# EAGLE design RELE_TTL (EAGLE 7.2.0)
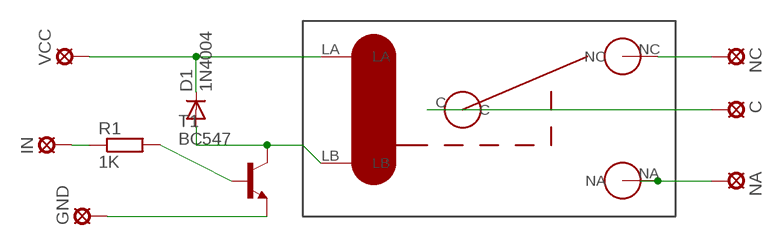
[diagram p0: schematic, sheet 1]

## Parts
C  LSP10  [LSP10]
D1  1N4004  [DO41-10]
GND  LSP10  [LSP10]
IN  LSP10  [LSP10]
NA  LSP10  [LSP10]
NC  LSP10  [LSP10]
R1  1K  R-EU_0207/2V  [0207/2V]
RL1  RELE  [RELE_1]
T1  BC547  [TO92]
VCC  LSP10  [LSP10]

## Nets
N$1: IN.MP R1.1
N$2: D1.C RL1.LA VCC.MP
N$3: D1.A RL1.LB T1.3(C)
N$4: R1.2 T1.2(B)
N$5: GND.MP T1.1(E)
N$6: NC.MP RL1.NC
N$7: C.MP RL1.C
N$8: NA.MP RL1.NA

## Library data of the parts
C GND IN NA NC VCC = solpad:LSP10: SOLDER PAD drill 1.0 mm, distributor Buerklin, 12H555
D1 = adafruit:1N4004: DIODE General purpose 1N400x type rectifier (With bigger pads) http://www.ladyada.net/library/pcb/eaglelibrary.html
R1 = rcl:R-EU_: RESISTOR, European symbol
RL1 = Erik:RELE
T1 = transistor:BC547: NPN TRANSISTOR

## Board
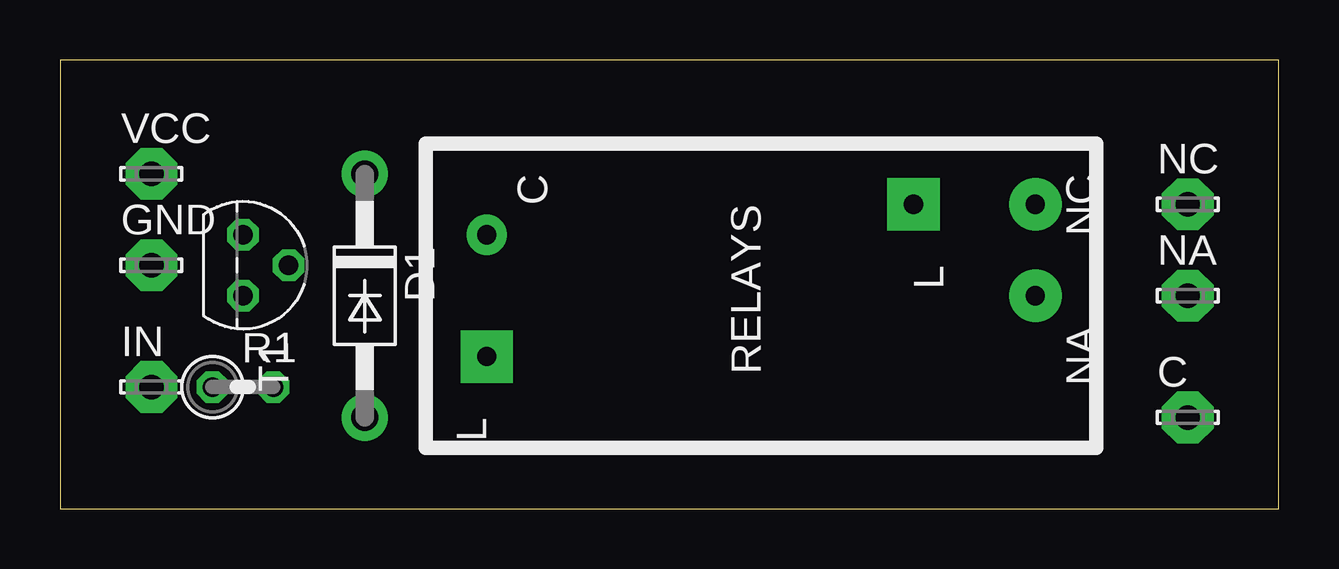
[diagram p1: board, top side]
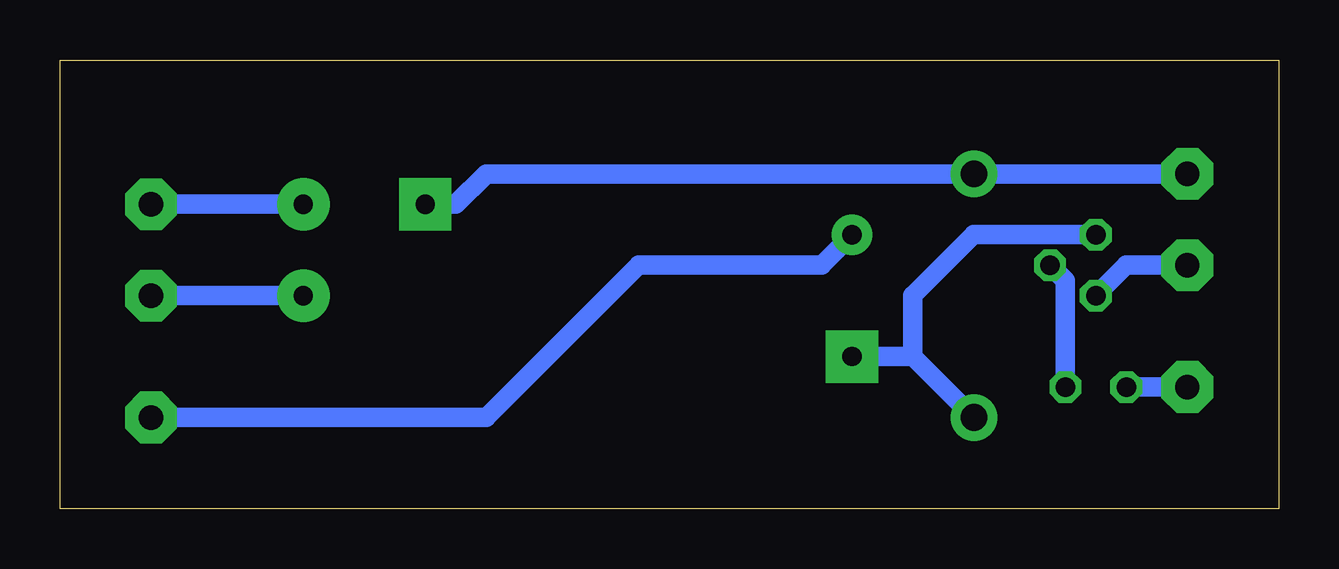
[diagram p2: board, bottom side, seen from below]

Size 50.78 x 18.72 mm. Coordinates in mm from the lower left corner, seen from the top.
Outline: 0,0 50.78,0 50.78,18.72 0,18.72 0,0
Copper layers (1*16): Top 0.035mm / dielectric 1.5mm / Bottom 0.035mm
Design rules "default": minimum track width 10mil, minimum drill 24mil, track to track 8mil, track to pad 8mil, pad to pad 8mil, via to via 8mil, smd to smd 8mil, copper to edge 40mil, drill to drill 8mil, minimum pad ring 10mil, minimum via ring 8mil, stop-mask expansion 4mil, vias tented up to drill 0mil, thermal gap 10mil

### Footprints (pad centres in the part's own frame; a part is rotated, then mirrored left to right if it is on the bottom)
LSP10 = drill 1.016 pad 2.159 octagon: MP 0,0
DO41-10 = drill 1.118 pad 1.93: A 5.08,0; C -5.08,0
0207/2V = drill 0.813 octagon: 1 -1.27,0; 2 1.27,0
RELE_1 = drill 0.8 pad 1.676: C -8.89,7.62 | drill 0.8 pad 2.184 square: LA -10.16,25.4; LB -3.81,7.62 | drill 0.8 pad 2.184: NA -6.35,30.48; NC -10.16,30.48
TO92 = drill 0.813 octagon: 1 1.27,0; 2 0,1.905; 3 -1.27,0

### Placement (x,y rotation side)
C  46.99,3.81 0 top
D1  12.7,8.89 270 top
GND  3.81,10.16 0 top
IN  3.81,5.08 0 top
NA  46.99,8.89 0 top
NC  46.99,12.7 0 top
R1  7.62,5.08 0 top
RL1  10.16,2.54 270 top
T1  7.62,10.16 270 top
VCC  3.81,13.97 0 top

### Tracks (layer width: path | path; a pad name or v marks a point on that pad's centre or on a via)
N$1
  Bottom 0.813: IN.MP R1.1
N$2
  Bottom 0.813: RL1.LA 34.29,12.7 33.02,13.97 D1.C VCC.MP
N$3
  Bottom 0.813: D1.A 15.24,6.35 | 15.24,6.35 RL1.LB | T1.3 12.7,11.43 15.24,8.89 15.24,6.35
N$4
  Bottom 0.813: T1.2 8.89,9.53 R1.2
N$5
  Bottom 0.813: T1.1 6.35,10.16 GND.MP
N$6
  Bottom 0.813: RL1.NC NC.MP
N$7
  Bottom 0.813: RL1.C 19.05,10.16 26.67,10.16 33.02,3.81 C.MP
N$8
  Bottom 0.813: RL1.NA NA.MP